# Altium schematic sheet [08] - DISPLAY.SchDoc
size A3; Organization: Altium Limited; Address1: L3, 12a Rodborough Rd; Address2: Frenchs Forest; Address3: NSW; Address4: Australia 2086; DocumentNumber: 9; SheetNumber: 8; SheetTotal: 10
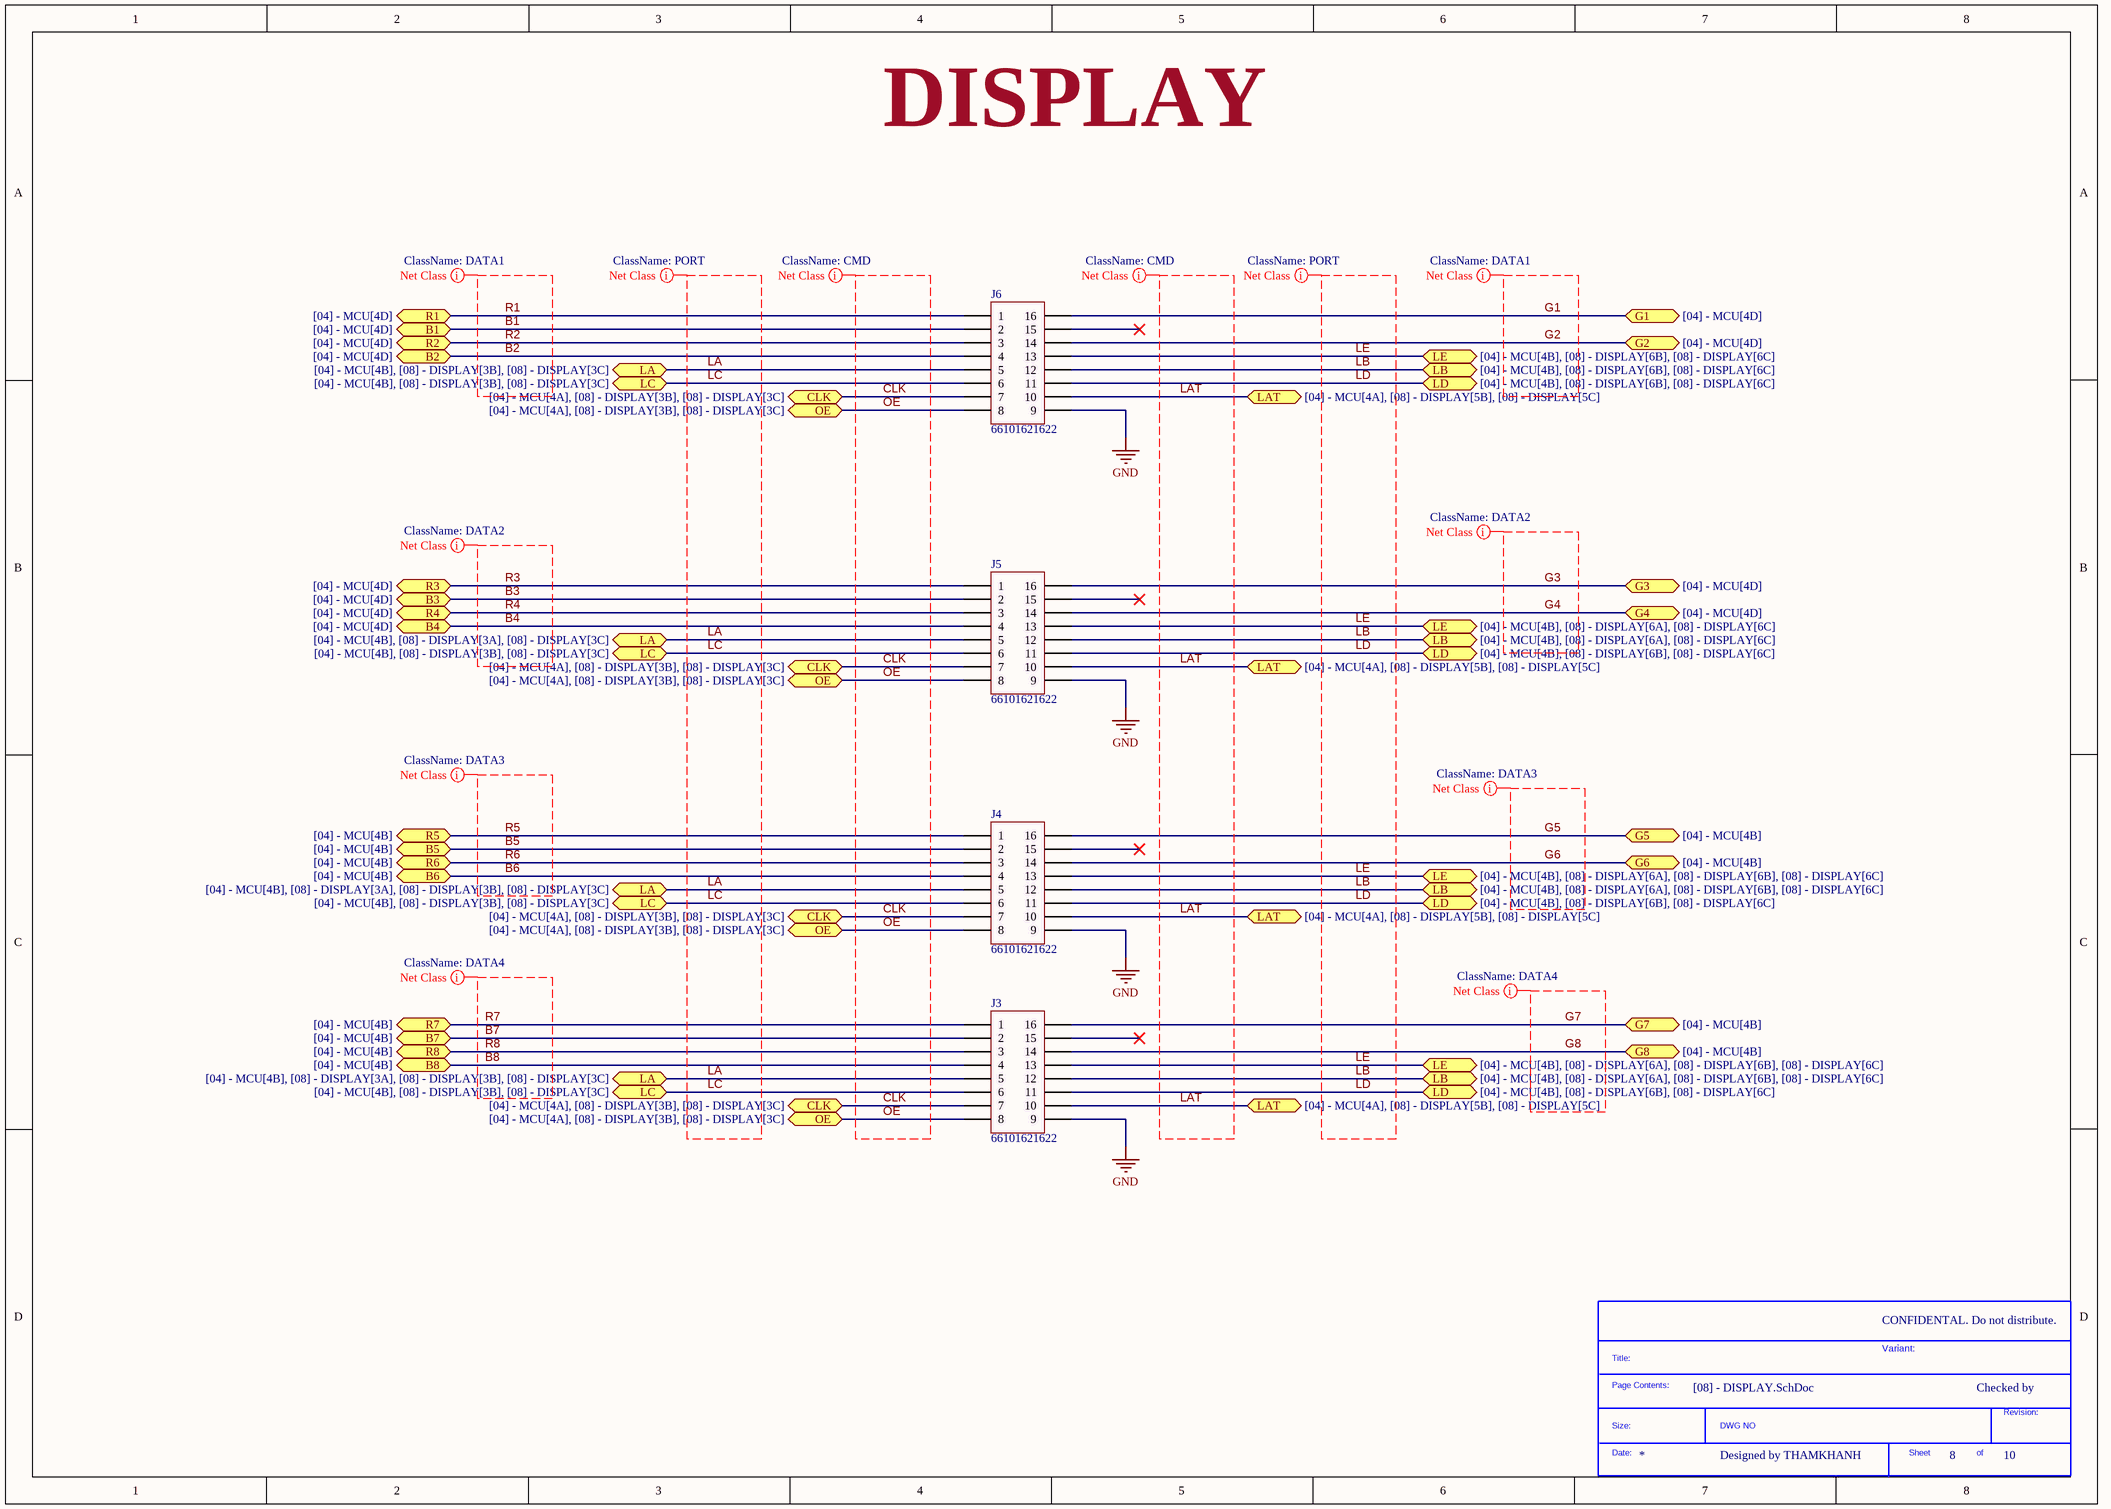
[diagram p0: [08] - DISPLAY.SchDoc]

## Parts
*?  SDTitleBlock  (value not drawn)  (graphical)
J3  66101621622  [66101621622]
J4  66101621622  [66101621622]
J5  66101621622  [66101621622]
J6  66101621622  [66101621622]

## Ports
B1 (bidir, see [04] - MCU[4D]), B2 (bidir, see [04] - MCU[4D]), B3 (bidir, see [04] - MCU[4D]), B4 (bidir, see [04] - MCU[4D]), B5 (bidir, see [04] - MCU[4B]), B6 (bidir, see [04] - MCU[4B]), B7 (bidir, see [04] - MCU[4B]), B8 (bidir, see [04] - MCU[4B]), CLK (bidir, see [04] - MCU[4A], [08] - DISPLAY[3B], [08] - DISPLAY[3C]), G1 (bidir, see [04] - MCU[4D]), G2 (bidir, see [04] - MCU[4D]), G3 (bidir, see [04] - MCU[4D]), G4 (bidir, see [04] - MCU[4D]), G5 (bidir, see [04] - MCU[4B]), G6 (bidir, see [04] - MCU[4B]), G7 (bidir, see [04] - MCU[4B]), G8 (bidir, see [04] - MCU[4B]), LA (bidir, see [04] - MCU[4B], [08] - DISPLAY[3A], [08] - DISPLAY[3B], [08] - DISPLAY[3C]), LA (bidir, see [04] - MCU[4B], [08] - DISPLAY[3A], [08] - DISPLAY[3C]), LA (bidir, see [04] - MCU[4B], [08] - DISPLAY[3B], [08] - DISPLAY[3C]), LAT (bidir, see [04] - MCU[4A], [08] - DISPLAY[5B], [08] - DISPLAY[5C]), LB (bidir, see [04] - MCU[4B], [08] - DISPLAY[6A], [08] - DISPLAY[6B], [08] - DISPLAY[6C]), LB (bidir, see [04] - MCU[4B], [08] - DISPLAY[6A], [08] - DISPLAY[6C]), LB (bidir, see [04] - MCU[4B], [08] - DISPLAY[6B], [08] - DISPLAY[6C]), LC (bidir, see [04] - MCU[4B], [08] - DISPLAY[3B], [08] - DISPLAY[3C]), LD (bidir, see [04] - MCU[4B], [08] - DISPLAY[6B], [08] - DISPLAY[6C]), LE (bidir, see [04] - MCU[4B], [08] - DISPLAY[6A], [08] - DISPLAY[6B], [08] - DISPLAY[6C]), LE (bidir, see [04] - MCU[4B], [08] - DISPLAY[6A], [08] - DISPLAY[6C]), LE (bidir, see [04] - MCU[4B], [08] - DISPLAY[6B], [08] - DISPLAY[6C]), OE (bidir, see [04] - MCU[4A], [08] - DISPLAY[3B], [08] - DISPLAY[3C]), R1 (bidir, see [04] - MCU[4D]), R2 (bidir, see [04] - MCU[4D]), R3 (bidir, see [04] - MCU[4D]), R4 (bidir, see [04] - MCU[4D]), R5 (bidir, see [04] - MCU[4B]), R6 (bidir, see [04] - MCU[4B]), R7 (bidir, see [04] - MCU[4B]), R8 (bidir, see [04] - MCU[4B])

## Nets
GND: J3.9 J4.9 J5.9 J6.9
B1: J6.2 ; port B1
B2: J6.4 ; port B2
B3: J5.2 ; port B3
B4: J5.4 ; port B4
B5: J4.2 ; port B5
B6: J4.4 ; port B6
B7: J3.2 ; port B7
B8: J3.4 ; port B8
CLK: J3.7 J4.7 J5.7 J6.7 ; port CLK
G1: J6.16 ; port G1
G2: J6.14 ; port G2
G3: J5.16 ; port G3
G4: J5.14 ; port G4
G5: J4.16 ; port G5
G6: J4.14 ; port G6
G7: J3.16 ; port G7
G8: J3.14 ; port G8
LA: J3.5 J4.5 J5.5 J6.5 ; port LA
LAT: J3.10 J4.10 J5.10 J6.10 ; port LAT
LB: J3.12 J4.12 J5.12 J6.12 ; port LB
LC: J3.6 J4.6 J5.6 J6.6 ; port LC
LD: J3.11 J4.11 J5.11 J6.11 ; port LD
LE: J3.13 J4.13 J5.13 J6.13 ; port LE
OE: J3.8 J4.8 J5.8 J6.8 ; port OE
R1: J6.1 ; port R1
R2: J6.3 ; port R2
R3: J5.1 ; port R3
R4: J5.3 ; port R4
R5: J4.1 ; port R5
R6: J4.3 ; port R6
R7: J3.1 ; port R7
R8: J3.3 ; port R8

Not connected (* = marked no-connect by the designer): J3 15*; J4 15*; J5 15*; J6 15*

## Layout directives
net class CMD: CLK, LAT, OE
net class DATA1: B1, B2, G1, G2, R1, R2
net class PORT: LA, LB, LC, LD, LE
net class DATA2: B3, B4, G3, G4, R3, R4
net class DATA3: B5, B6, G5, G6, R5, R6
net class DATA4: B7, B8, G7, G8, R7, R8

## Notes on the sheet
- DISPLAY
- CONFIDENTAL. Do not distribute.
- Variant:
- Checked by
- Designed by THAMKHANH
- Title
- Size:
- Date:
- A3
- Number:
- Time:
- Revision:
- Sheet
- of
- File:
- (in symbol SDTitleBlock) Title:; Page Contents:; Revision:; Size:; DWG NO; Date:; Sheet; of

## Library data of the parts
J3-J6 = LHeader 16 Dual 2.54MM: Manufacturer: Wurth Elektronik; ComponentLink1 Description: Manufacturer; ComponentLink2 Description: Datasheet; NoPins: 16; Created Date: March 2016; partNo: 66101621622; ComponentLink1URL: http://www.we-online.com; ComponentLink2URL: http://katalog.we-online.de/em/datasheet/6610XX11622.pdf; Created by: Baojun Chen